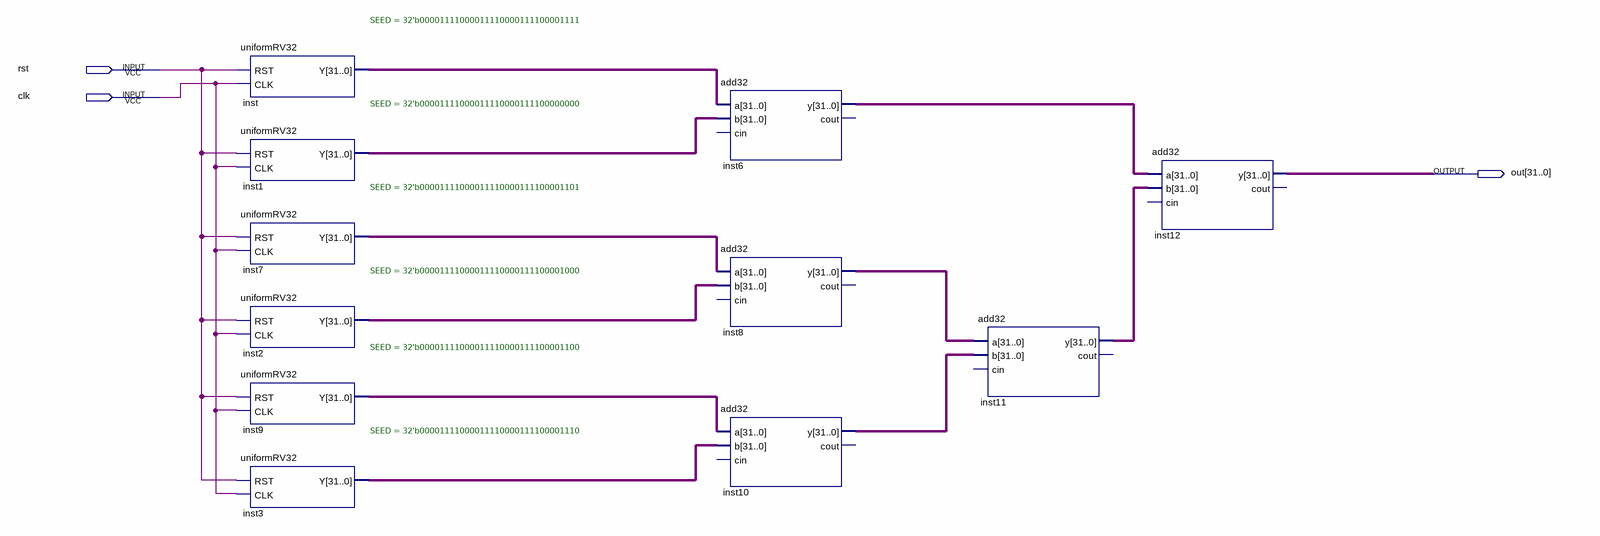
[diagram p0: schematic sheet]
// Quartus schematic noise_block.bdf as structural Verilog: 11 symbols, 3 pins
module noise_block (
  input  rst,
  input  clk,
  output [31:0] out
);

  wire [31:0] inst1_y, inst2_y, inst3_y, inst6_y, inst7_y, inst8_y, inst9_y, inst10_y, inst11_y, inst_y;

  uniformRV32 #(.SEED(32'b00001111000011110000111100001111)) inst (.RST(rst), .CLK(clk), .Y(inst_y));
  uniformRV32 #(.SEED(32'b00001111000011110000111100000000)) inst1 (.RST(rst), .CLK(clk), .Y(inst1_y));
  uniformRV32 #(.SEED(32'b00001111000011110000111100001101)) inst7 (.RST(rst), .CLK(clk), .Y(inst7_y));
  uniformRV32 #(.SEED(32'b00001111000011110000111100001000)) inst2 (.RST(rst), .CLK(clk), .Y(inst2_y));
  uniformRV32 #(.SEED(32'b00001111000011110000111100001100)) inst9 (.RST(rst), .CLK(clk), .Y(inst9_y));
  uniformRV32 #(.SEED(32'b00001111000011110000111100001110)) inst3 (.RST(rst), .CLK(clk), .Y(inst3_y));
  add32 inst6 (.a(inst_y), .b(inst1_y), .y(inst6_y));  // open: cin, cout
  add32 inst8 (.a(inst7_y), .b(inst2_y), .y(inst8_y));  // open: cin, cout
  add32 inst10 (.a(inst9_y), .b(inst3_y), .y(inst10_y));  // open: cin, cout
  add32 inst11 (.a(inst8_y), .b(inst10_y), .y(inst11_y));  // open: cin, cout
  add32 inst12 (.a(inst6_y), .b(inst11_y), .y(out));  // open: cin, cout
endmodule
